# EAGLE design OBC_QB50 (EAGLE 6.5.0)
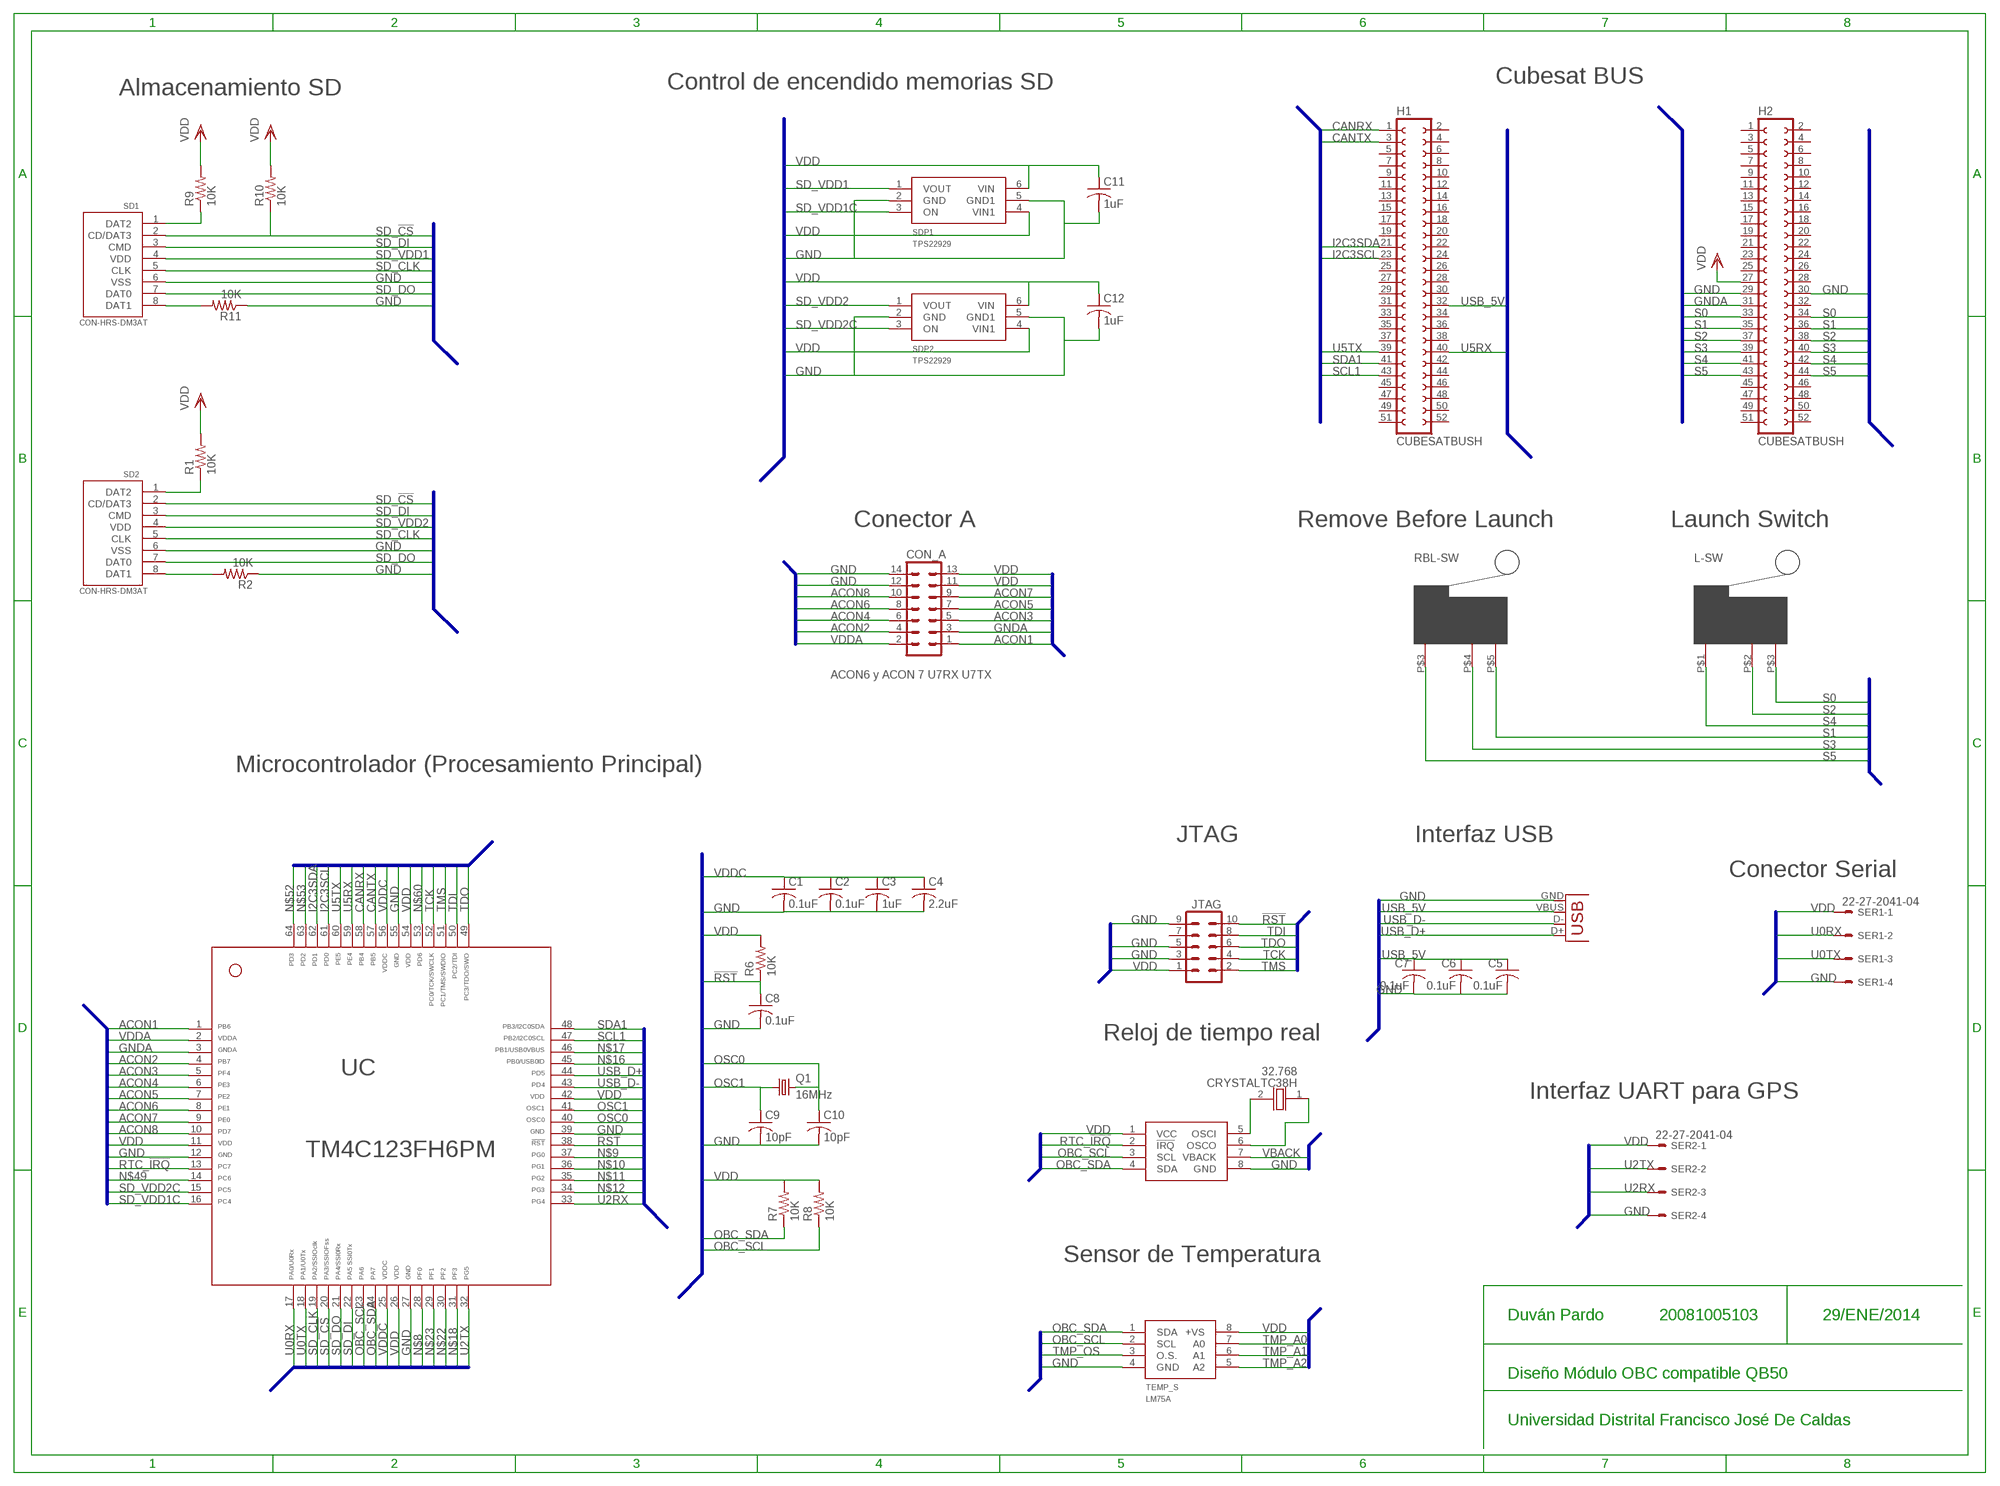
[diagram p0: schematic, sheet 1]

## Parts
32.768  CRYSTALTC38H  [TC38H]
C1  0.1uF  C-USC0402  [C0402]
C2  0.1uF  C-USC0402  [C0402]
C3  1uF  C-USC0402  [C0402]
C4  2.2uF  C-USC0402  [C0402]
C5  0.1uF  C-USC0402  [C0402]
C6  0.1uF  C-USC0402  [C0402]
C7  0.1uF  C-USC0402  [C0402]
C8  0.1uF  C-USC0402  [C0402]
C9  10pF  C-USC0402  [C0402]
C10  10pF  C-USC0402  [C0402]
C11  1uF  C-USC0402  [C0402]
C12  1uF  C-USC0402  [C0402]
CON_A  ML14  [ML14]
H1  CUBESATBUSH  [CUBESATBUS]
H2  CUBESATBUSH  [CUBESATBUS]
JTAG  ML10  [ML10]
L-SW  SW_E61-SERIESCON  [CON]
Q1  16MHz  CRYSTALHC49UP  [HC49UP]
R1  10K  R-US_MELF0102R  [MINI_MELF-0102R]
R2  10K  R-US_MELF0102R  [MINI_MELF-0102R]
R6  10K  R-US_MELF0102R  [MINI_MELF-0102R]
R7  10K  R-US_MELF0102R  [MINI_MELF-0102R]
R8  10K  R-US_MELF0102R  [MINI_MELF-0102R]
R9  10K  R-US_MELF0102R  [MINI_MELF-0102R]
R10  10K  R-US_MELF0102R  [MINI_MELF-0102R]
R11  10K  R-US_MELF0102R  [MINI_MELF-0102R]
RBL-SW  SW_E61-SERIES  [E61-SERIES]
RTC  BQ32008SOIC  [SOP08]
SD1  CON-HRS-DM3AT  [HRS-DM3AT]
SD2  CON-HRS-DM3AT  [HRS-DM3AT]
SDP1  TPS22929  [SOT23-6L]
SDP2  TPS22929  [SOT23-6L]
SER1  22-27-2041-04  [6410-04]
SER2  22-27-2041-04  [6410-04]
TEMP_S  LM75A  [SOP08]
UC  TM4C123FH6PM  [TM4C123FH6PM]
USB  USB-B-H  [USB-B-H]

## Nets
!RST: C8.1 JTAG.10 R6.1 UC.38
ACON1: CON_A.1 UC.1
ACON2: CON_A.4 UC.4
ACON3: CON_A.5 UC.5
ACON4: CON_A.6 UC.6
ACON5: CON_A.7 UC.7
ACON6: CON_A.8 UC.8
ACON7: CON_A.9 UC.9
ACON8: CON_A.10 UC.10
CANRX: H1.1 UC.58
CANTX: H1.3 UC.57
GND: C1.2 C2.2 C3.2 C4.2 C5.2 C6.2 C7.2 C8.2 C9.2 C10.2 C11.2 C12.2 CON_A.12 CON_A.14 H2.29 H2.30 JTAG.3 JTAG.5 JTAG.9 R2.1 R11.1 RTC.8(GND) SD1.6(VSS) SD2.6(VSS) SDP1.2(GND) SDP1.5(GND1) SDP2.2(GND) SDP2.5(GND1) SER1.4 SER2.4 TEMP_S.4(GND) UC.12 UC.27 UC.39 UC.55 USB.GND
GNDA: CON_A.3 H2.31 UC.3
I2C3SCL: H1.23 UC.61
I2C3SDA: H1.21 UC.62
N$3: R1.1 SD2.1(DAT2)
N$4: R2.2 SD2.8(DAT1)
N$5: 32.768.2(X2) RTC.5(OSCI)
N$6: 32.768.1(X1) RTC.6(OSCO)
N$8: UC.28
N$9: UC.37
N$10: UC.36
N$11: UC.35
N$12: UC.34
N$15: R9.1 SD1.1(DAT2)
N$16: UC.45
N$17: UC.46
N$18: UC.31
N$19: R11.2 SD1.8(DAT1)
N$22: UC.30
N$23: UC.29
N$49: UC.14
N$52: UC.64
N$53: UC.63
N$60: UC.53
OBC_SCL: R8.1 RTC.3(SCL) TEMP_S.2(SCL) UC.23
OBC_SDA: R7.1 RTC.4(SDA) TEMP_S.1(SDA) UC.24
OSC0: C10.1 Q1.2 UC.40
OSC1: C9.1 Q1.1 UC.41
RTC_!IRQ: RTC.2(!IRQ) UC.13
S0: H2.33 H2.34 L-SW.P$3(NC)
S1: H2.35 H2.36 RBL-SW.P$5(NC)
S2: H2.37 H2.38 L-SW.P$2(NO)
S3: H2.39 H2.40 RBL-SW.P$4(NO)
S4: H2.41 H2.42 L-SW.P$1(C)
S5: H2.43 H2.44 RBL-SW.P$3(C)
SCL1: H1.43 UC.47
SD_!CS: R10.1 SD1.2(CD/DAT3) SD2.2(CD/DAT3) UC.20
SD_CLK: SD1.5(CLK) SD2.5(CLK) UC.19
SD_DI: SD1.3(CMD) SD2.3(CMD) UC.22
SD_DO: SD1.7(DAT0) SD2.7(DAT0) UC.21
SD_VDD1: SD1.4(VDD) SDP1.1(VOUT)
SD_VDD1C: SDP1.3(ON) UC.16
SD_VDD2: SD2.4(VDD) SDP2.1(VOUT)
SD_VDD2C: SDP2.3(ON) UC.15
SDA1: H1.41 UC.48
TCK: JTAG.4 UC.52
TDI: JTAG.8 UC.50
TDO: JTAG.6 UC.49
TMP_A0: TEMP_S.7(A0)
TMP_A1: TEMP_S.6(A1)
TMP_A2: TEMP_S.5(A2)
TMP_OS: TEMP_S.3(O.S.)
TMS: JTAG.2 UC.51
U0RX: SER1.2 UC.17
U0TX: SER1.3 UC.18
U2RX: SER2.3 UC.33
U2TX: SER2.2 UC.32
U5RX: H1.40 UC.59
U5TX: H1.39 UC.60
USB_5V: C5.1 C6.1 C7.1 H1.32 USB.VBUS
USB_D+: UC.44 USB.D+
USB_D-: UC.43 USB.D-
VBACK: RTC.7(VBACK)
VDD: C11.1 C12.1 CON_A.11 CON_A.13 H2.27 JTAG.1 R1.2 R6.2 R7.2 R8.2 R9.2 R10.2 RTC.1(VCC) SDP1.4(VIN1) SDP1.6(VIN) SDP2.4(VIN1) SDP2.6(VIN) SER1.1 SER2.1 TEMP_S.8(+VS) UC.11 UC.26 UC.42 UC.54
VDDA: CON_A.2 UC.2
VDDC: C1.1 C2.1 C3.1 C4.1 UC.25 UC.56
Unconnected: H1.2 H1.4 H1.5 H1.6 H1.7 H1.8 H1.9 H1.10 H1.11 H1.12 H1.13 H1.14 H1.15 H1.16 H1.17 H1.18 H1.19 H1.20 H1.22 H1.24 H1.25 H1.26 H1.27 H1.28 H1.29 H1.30 H1.31 H1.33 H1.34 H1.35 H1.36 H1.37 H1.38 H1.42 H1.44 H1.45 H1.46 H1.47 H1.48 H1.49 H1.50 H1.51 H1.52 H2.1 H2.2 H2.3 H2.4 H2.5 H2.6 H2.7 H2.8 H2.9 H2.10 H2.11 H2.12 H2.13 H2.14 H2.15 H2.16 H2.17 H2.18 H2.19 H2.20 H2.21 H2.22 H2.23 H2.24 H2.25 H2.26 H2.28 H2.32 H2.45 H2.46 H2.47 H2.48 H2.49 H2.50 H2.51 H2.52 JTAG.7

## Buses
B$1
B$2
B$3
B$4
B$5
B$6
B$7
B$8
B$9
B$10
B$11
B$12
B$13
B$14
B$15
B$16
B$17
B$18
B$19
B$20
B$21
B$22
B$23

## Notes on the sheet
- Control de encendido memorias SD
- Cubesat BUS
- Almacenamiento SD
- Conector A | Remove Before Launch | Launch Switch
- ACON6 y ACON 7 U7RX U7TX
- Microcontrolador (Procesamiento Principal)
- JTAG | Interfaz USB
- Conector Serial
- Reloj de tiempo real
- Interfaz UART para GPS
- Sensor de Temperatura
- Duván Pardo | 20081005103 | 29/ENE/2014
- Diseño Módulo OBC compatible QB50
- Universidad Distrital Francisco José De Caldas

## Library data of the parts
32.768 = CR_32.768k:CRYSTAL: Generic Crystal TC38H 32.768
C1-C12 = rcl:C-US: CAPACITOR, American symbol
CON_A = con-ml:ML14: HARTING; OC_FARNELL: unknown; OC_NEWARK: unknown
H1 H2 = freetronics-jon:CUBESATBUS
JTAG = con-ml:ML10: HARTING; OC_FARNELL: unknown; OC_NEWARK: unknown
L-SW RBL-SW = SW_E61-Series:SW_E61-SERIES: SW-E61-SERIES
Q1 = crystal:CRYSTAL: CRYSTAL; OC_FARNELL: unknown; OC_NEWARK: unknown
R1 R2 R6-R11 = rcl:R-US_: RESISTOR, American symbol
RTC = BQ32000:BQ3200
SD1 SD2 = BreakoutBoard:CON-HRS-DM3AT: Hirose DM3AT microSD card connector Hirose DM3AT Push-Push (ejection mechanism), top board mounting microSD card connector Source: http://www.hirose.co.jp/cataloge_hp/e60900232.pdf; DIGI-KEY#: HR1964CT-ND; MF: Hirose; MPN: DM3AT-SF-PEJM5; TERMINATION-TYPE: Right-angle SMT (standard)
SDP1 SDP2 = TPS22929:TPS22929: Description The TPS22929 is a small, low rON load switch with controlled turn on. The device contains a P-channel MOSFET that can operate over an input voltage range of 1.4 V to 5.5 V. The switch is controlled by an on/off input (ON), which is capable of interfacing directly with low-voltage control signals. The TPS22929 is active high enable. The TPS22929 contains a 150-Ω on-chip load resistor for quick output discharge when the switch is turned off. The rise time of the device is internally controlled in order to avoid inrush current. The TPS22929 family has various slew rate options. The TPS22929 device provides circuit breaker functionality by latching off the power-switch during reverse voltage situations. An internal reverse voltage comparator disables the power-switch when the output voltage (VOUT) is driven higher than the input (VIN) to quickly (10µs typ) stop the flow of current towards the input side of the switch. Reverse current is always active, even when the power-switch is disabled. Additionally, under-voltage lockout (UVLO) protection turns the switch off if the input voltage is too low. The TPS22929 is available in an small, space-saving 6-pin SOT23-6 package and is characterized for operation over the free-air temperature range of –40°C to 85°C.
SER1 SER2 = con-molex:22-?-04: CONNECTOR wire to board 2.54 mm (.1 inch) pitch header; OC_FARNELL: unknown; OC_NEWARK: unknown
TEMP_S = LM75A:LM75A
UC = tm4C123FH6PMlbr:TM4C123FH6PM: TM4C123FH6PM
USB = con-usb:USB: USB Connectors

## Board
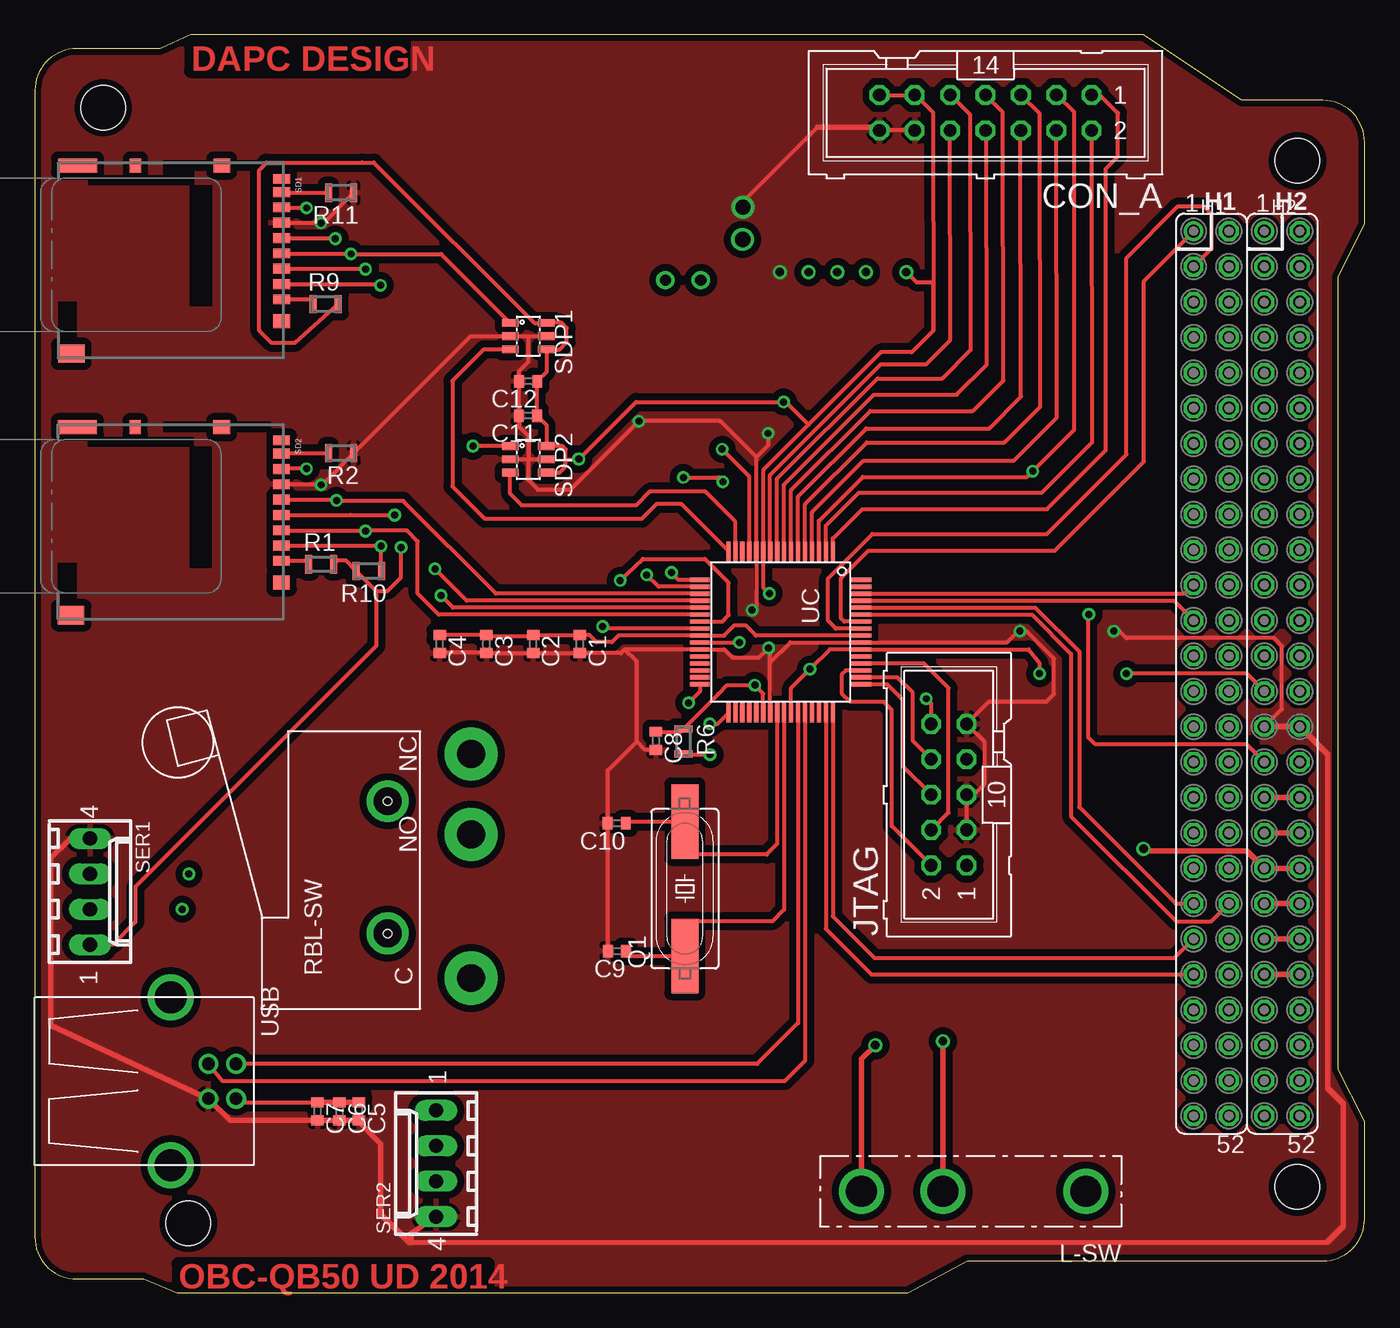
[diagram p1: board, top side]
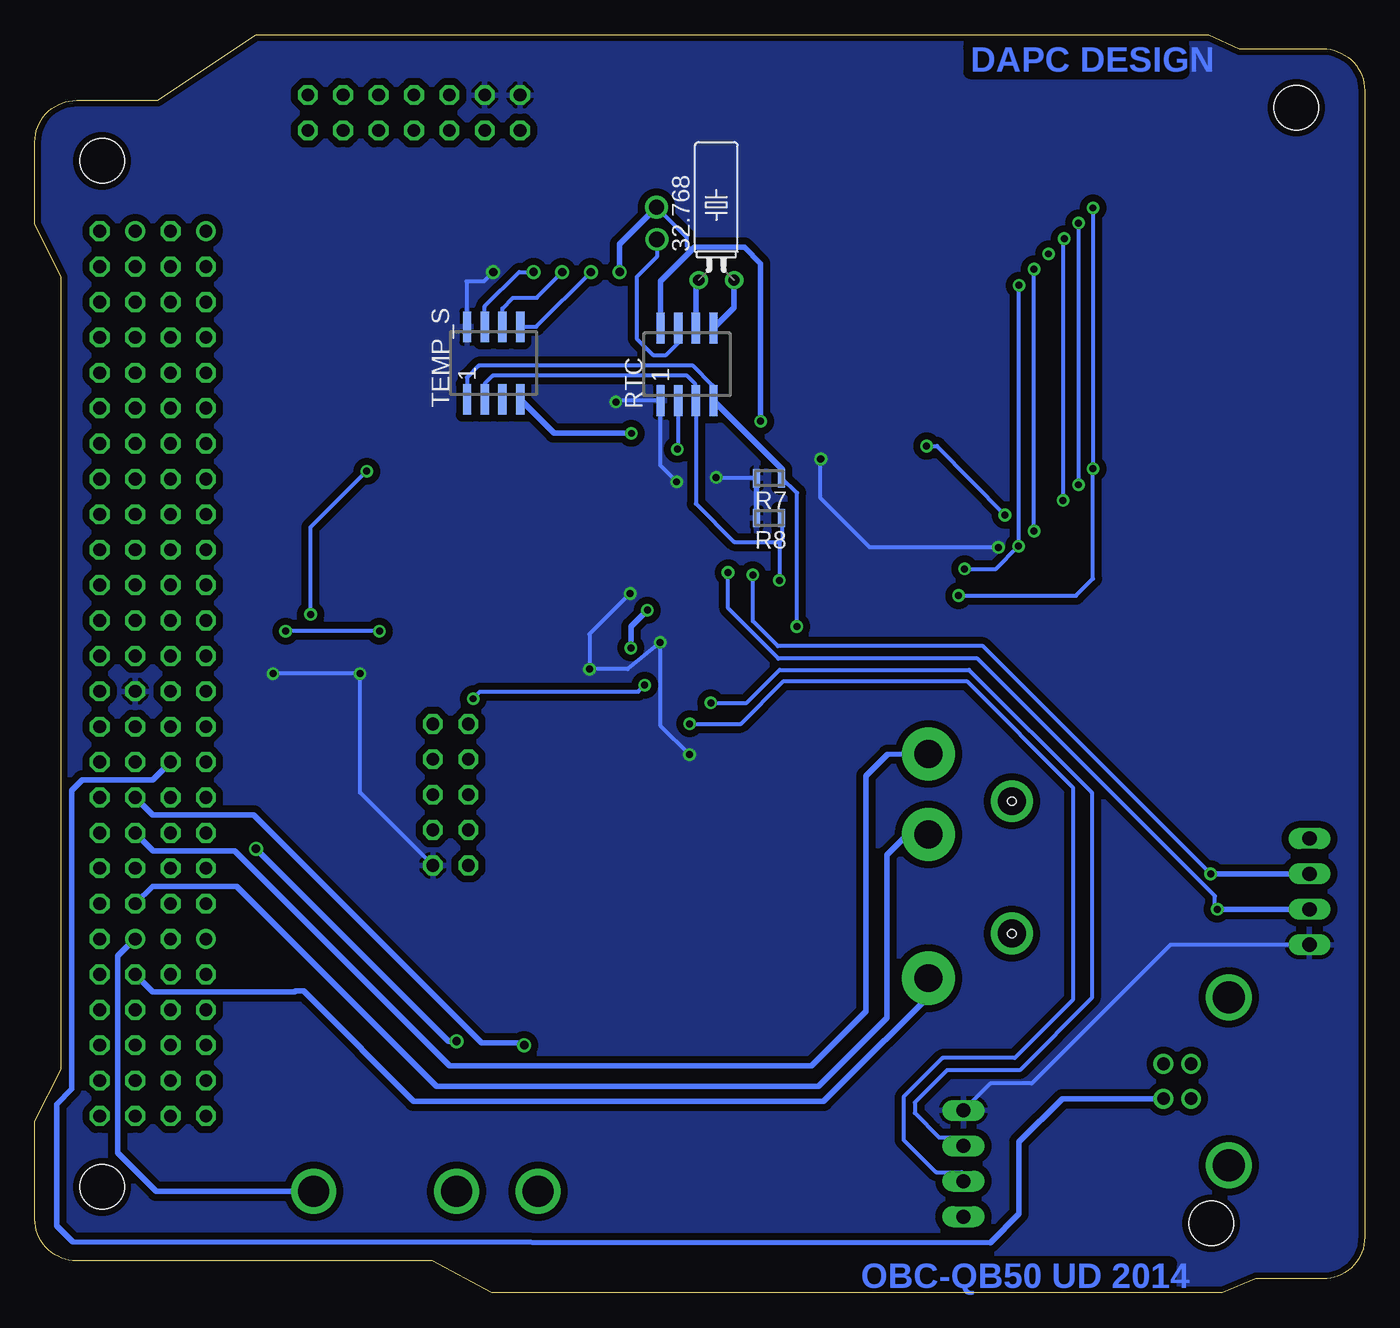
[diagram p2: board, bottom side, seen from below]

Size 95.45 x 90.3 mm. Coordinates in mm from the lower left corner, seen from the top.
Outline: 0,4 arc90 3,1 7.81,1 10.23,0 62.65,0 66.94,2.3 92.45,2.3 arc90 95.45,5.3 95.45,12.31 93.55,16.05 93.55,72.91 95.45,76.74 95.45,82.6 arc90 92.45,85.6 86.64,85.6 79.56,90.3 11.2,90.3 9,89.3 3,89.3 arc90 0,86.3 0,4
Copper layers (1+2*15+16): Top 0.035mm / dielectric 1.5mm / Route2 0.035mm / dielectric 0.15mm / Route15 0.035mm / dielectric 0.2mm / Bottom 0.035mm
Design rules "default *": minimum track width 6mil, minimum drill 24mil, track to track 0.5mm, track to pad 0.5mm, pad to pad 0.5mm, via to via 0.5mm, smd to smd 0.5mm, copper to edge 18mil, drill to drill 8mil, minimum pad ring 10mil, minimum via ring 8mil, stop-mask expansion 4mil, vias tented up to drill 0mil, thermal gap 10mil
Holes 3.2 mm at 11.02,5 4.91,85.07 90.63,81.26 90.63,7.6

### Footprints (pad centres in the part's own frame; a part is rotated, then mirrored left to right if it is on the bottom)
TC38H = drill 0.813: 1 -1.27,0; 2 1.27,0
C0402 = smd 0.7 x 0.9: 1 -0.65,0; 2 0.65,0
ML14 = drill 0.914 octagon: 1 -7.62,-1.27; 2 -7.62,1.27; 3 -5.08,-1.27; 4 -5.08,1.27; 5 -2.54,-1.27; 6 -2.54,1.27; 7 0,-1.27; 8 0,1.27; 9 2.54,-1.27; 10 2.54,1.27; 11 5.08,-1.27; 12 5.08,1.27; 13 7.62,-1.27; 14 7.62,1.27
CUBESATBUS = drill 0.914: 1 -31.75,-1.27; 41 19.05,-1.27 | drill 0.914 octagon: 2 -31.75,1.27; 3 -29.21,-1.27; 4 -29.21,1.27; 5 -26.67,-1.27; 6 -26.67,1.27; 7 -24.13,-1.27; 8 -24.13,1.27; 9 -21.59,-1.27; 10 -21.59,1.27; 11 -19.05,-1.27; 12 -19.05,1.27; 13 -16.51,-1.27; 14 -16.51,1.27; 15 -13.97,-1.27; 16 -13.97,1.27; 17 -11.43,-1.27; 18 -11.43,1.27; 19 -8.89,-1.27; 20 -8.89,1.27; 21 -6.35,-1.27; 22 -6.35,1.27; 23 -3.81,-1.27; 24 -3.81,1.27; 25 -1.27,-1.27; 26 -1.27,1.27; 27 1.27,-1.27; 28 1.27,1.27; 29 3.81,-1.27; 30 3.81,1.27; 31 6.35,-1.27; 32 6.35,1.27; 33 8.89,-1.27; 34 8.89,1.27; 35 11.43,-1.27; 36 11.43,1.27; 37 13.97,-1.27; 38 13.97,1.27; 39 16.51,-1.27; 40 16.51,1.27; 42 19.05,1.27; 43 21.59,-1.27; 44 21.59,1.27; 45 24.13,-1.27; 46 24.13,1.27; 47 26.67,-1.27; 48 26.67,1.27; 49 29.21,-1.27; 50 29.21,1.27; 51 31.75,-1.27; 52 31.75,1.27
ML10 = drill 0.914 octagon: 1 -5.08,-1.27; 2 -5.08,1.27; 3 -2.54,-1.27; 4 -2.54,1.27; 5 0,-1.27; 6 0,1.27; 7 2.54,-1.27; 8 2.54,1.27; 9 5.08,-1.27; 10 5.08,1.27
CON = drill 2.2: P$1 -8.89,0; P$2 1.37,0; P$3 7.22,0
HC49UP = smd 5.334 x 1.93: 1 -4.826,0; 2 4.826,0
MINI_MELF-0102R = smd 0.5 x 1.3: 1 -0.9,0; 2 0.9,0
E61-SERIES = drill 2 pad 2.184: P$1 -4.61,-2.16; P$2 4.89,-2.16 | drill 2 pad 3.81: P$3 -7.81,-8.16; P$4 2.49,-8.16; P$5 8.29,-8.16 | hole 0.6: -4.61,-2.16; 4.89,-2.16
SOP08 = smd 0.6 x 2.2: 1 -1.905,-2.6; 2 -0.635,-2.6; 3 0.635,-2.6; 4 1.905,-2.6; 5 1.905,2.6; 6 0.635,2.6; 7 -0.635,2.6; 8 -1.905,2.6
HRS-DM3AT = smd 0.7 x 1.2: 1 2.54,9.49; 2 1.44,9.49; 3 0.34,9.49; 4 -0.76,9.49; 5 -1.86,9.49; 6 -2.96,9.49; 7 -4.06,9.49; 8 -5.16,9.49; B -6.11,9.49 | smd 1 x 0.8: A -7.06,-1.01 | smd 1 x 1.2: MNT@1 -7.06,5.19; MNT@4 4.09,9.49 | smd 1 x 2.8: MNT@2 -7.06,-5.16 | smd 1.3 x 1.9: MNT@3 6.44,-5.61
SOT23-6L = smd 0.55 x 1.2: 1 -0.95,-1.3; 2 0,-1.3; 3 0.95,-1.3; 4 0.95,1.3; 5 0,1.3; 6 -0.95,1.3
6410-04 = drill 1.016 long: 1 3.81,0; 2 1.27,0; 3 -1.27,0; 4 -3.81,0
TM4C123FH6PM = smd 1.4 x 0.3: 1 -5.8,3.75; 2 -5.8,3.25; 3 -5.8,2.75; 4 -5.8,2.25; 5 -5.8,1.75; 6 -5.8,1.25; 7 -5.8,0.75; 8 -5.8,0.25; 9 -5.8,-0.25; 10 -5.8,-0.75; 11 -5.8,-1.25; 12 -5.8,-1.75; 13 -5.8,-2.25; 14 -5.8,-2.75; 15 -5.8,-3.25; 16 -5.8,-3.75; 33 5.8,-3.75; 34 5.8,-3.25; 35 5.8,-2.75; 36 5.8,-2.25; 37 5.8,-1.75; 38 5.8,-1.25; 39 5.8,-0.75; 40 5.8,-0.25; 41 5.8,0.25; 42 5.8,0.75; 43 5.8,1.25; 44 5.8,1.75; 45 5.8,2.25; 46 5.8,2.75; 47 5.8,3.25; 48 5.8,3.75 | smd 0.3 x 1.4: 17 -3.75,-5.8; 18 -3.25,-5.8; 19 -2.75,-5.8; 20 -2.25,-5.8; 21 -1.75,-5.8; 22 -1.25,-5.8; 23 -0.75,-5.8; 24 -0.25,-5.8; 25 0.25,-5.8; 26 0.75,-5.8; 27 1.25,-5.8; 28 1.75,-5.8; 29 2.25,-5.8; 30 2.75,-5.8; 31 3.25,-5.8; 32 3.75,-5.8; 49 3.75,5.8; 50 3.25,5.8; 51 2.75,5.8; 52 2.25,5.8; 53 1.75,5.8; 54 1.25,5.8; 55 0.75,5.8; 56 0.25,5.8; 57 -0.25,5.8; 58 -0.75,5.8; 59 -1.25,5.8; 60 -1.75,5.8; 61 -2.25,5.8; 62 -2.75,5.8; 63 -3.25,5.8; 64 -3.75,5.8
USB-B-H = drill 0.914: D+ 0,1.25; D- 1.981,1.25; GND 0,-1.25; VBUS 1.981,-1.25 | drill 2.286: P$1 -2.718,-6.02; P$2 -2.718,6.02

### Placement (x,y rotation side)
32.768  46.53,72.69 0 bottom
C1  39.12,46.57 270 top
C2  35.76,46.57 270 top
C3  32.41,46.57 270 top
C4  29.06,46.57 270 top
C5  23.27,13.03 270 top
C6  21.87,13.03 270 top
C7  20.29,13.03 270 top
C8  44.58,39.62 270 top
C9  41.78,24.54 180 top
C10  41.76,33.71 180 top
C11  35.39,62.97 180 top
C12  35.41,65.44 180 top
CON_A  68.24,84.71 180 top
H1  84.44,44.45 270 top
H2  89.52,44.45 270 top
JTAG  65.61,35.76 90 top
L-SW  66.55,7.29 180 top
Q1  46.66,29.01 90 top
R1  20.56,52.3 0 top
R2  21.98,60.27 180 top
R6  46.57,39.59 270 top
R7  42.75,58.47 180 bottom
R8  42.75,55.63 180 bottom
R9  20.88,70.97 0 top
R10  23.98,51.8 180 top
R11  21.97,78.96 180 top
RBL-SW  23.16,30.4 90 top
RTC  48.64,66.65 0 bottom
SD1  8.23,73.85 270 top
SD2  8.22,55.08 270 top
SDP1  35.42,68.67 270 top
SDP2  35.42,59.83 270 top
SER1  3.96,28.8 270 top
SER2  28.8,9.28 90 top
TEMP_S  62.52,66.74 0 bottom
UC  53.53,47.43 270 top
USB  12.46,15.19 0 top

### Tracks (layer width: path | path; a pad name or v marks a point on that pad's centre or on a via)
!RST  (via drill 0.5)
  Top 0.305: R6.1 46.72,40.57 | 63.98,42.67 v63.98,42.65 64.34,42.29 JTAG.10 | R6.1 49.06,43 49.68,43.62 v51.68,43.62 52.28,43.02 UC.38 | C8.1 46.33,40.27 R6.1
  Bottom 0.305: v63.98,42.65 63.47,43.15 52.15,43.15 v51.68,43.62
ACON1
  Top 0.305: CON_A.1 76.44,85.98 77.74,84.68 77.74,81.56 76.86,80.68 76.86,60.48 72.64,56.26 59.39,56.26 57.28,54.15 UC.1
ACON2
  Top 0.305: UC.4 55.78,56.04 59.48,59.74 70.27,59.74 73.36,62.83 CON_A.4
ACON3
  Top 0.305: UC.5 55.28,56.6 59.71,61.04 69.59,61.04 72.16,63.61 72.12,84.63 CON_A.5
ACON4
  Top 0.305: UC.6 54.78,57.16 59.68,62.05 68.5,62.05 70.79,64.34 70.75,83.44 CON_A.6
ACON5
  Top 0.305: UC.7 54.28,57.62 59.96,63.3 67.32,63.3 69.52,65.5 69.48,84.73 CON_A.7
ACON6
  Top 0.305: UC.8 53.78,58.02 60.23,64.47 66.15,64.47 68.33,66.64 68.29,83.44 CON_A.8
ACON7
  Top 0.305: UC.9 53.28,58.43 60.48,65.63 65.12,65.63 67.18,67.69 67.14,84.58 65.74,85.98 CON_A.9
ACON8
  Top 0.305: UC.10 52.78,58.71 60.72,66.65 63.98,66.65 65.71,68.38 65.67,83.44 CON_A.10
CANRX
  Top 0.305: UC.58 58.1,48.18 57.86,48.42 57.86,51.3 59.84,53.28 73.2,53.28 79.6,59.68 79.6,72.63 H1.1
CANTX
  Top 0.305: UC.57 57.5,47.68 56.93,48.25 56.93,51.29 60.11,54.47 72.64,54.47 78.35,60.17 78.35,74.28 82.05,77.99 83.91,77.99 84.45,77.44 84.45,74.94 H1.3
GND  (via drill 0.5, 0.6, 1.1)
  Top 0.305: 52.78,45.24 54.23,46.69 UC.55 69.77,46.68 70.59,47.5 v70.71,47.5 71.17,47.5 73.15,45.52 73.15,43 72.59,42.44 68.48,42.44 JTAG.9 68.15,39.57 68.15,36.5 67.41,35.76 JTAG.5 JTAG.3 | C4.2 29.03,45.92 29.03,45.99 32.41,45.99 C3.2 32.44,45.92 32.44,45.94 C2.2 C1.2 42.08,45.92 42.34,46.18 | 42.34,46.18 UC.27 49.48,46.18 50.08,45.59 51.97,45.59 v52.67,46.29 52.78,46.18 52.78,45.24 | H2.29 89.51,41.9 89.51,46.43 88.95,46.99 78.36,46.99 77.85,47.5 v77.44,47.5 | C8.2 43.8,38.97 43.21,39.57 | 43.21,39.57 43.21,45.32 42.34,46.18 | C10.2 41.13,33.71 C9.2 41.13,37.5 43.21,39.57 | 51.78,59.98 UC.12 51.78,49.3 v51.49,49.01 | 51.78,59.98 49.2,62.56 v43.36,62.56 | CON_A.12 CON_A.14 arc90 60.39,83.67 | v50.83,77.93 50.83,78.32 56.17,83.67 | 35.52,68.67 SDP1.2 31.28,68.67 R2.1 20.61,58 v20.54,58 20.54,58.04 SD2.6 | 35.52,68.67 SDP1.5 | 35.42,59.83 35.39,59.83 | 35.39,59.83 SDP2.2 | 35.52,68.67 35.42,68.57 35.42,66.83 34.76,66.16 C12.2 34.74,65.43 C11.2 34.75,62.17 35.42,61.49 35.42,59.83 | SDP2.5 35.42,59.83 | 43.17,62.56 v43.36,62.56 | 35.39,59.83 35.39,58.37 36.11,57.66 38.46,57.66 v43.36,62.56 | v52.63,61.7 52.63,60.83 51.78,59.98 | SD1.6 20.54,76.81 v20.54,76.8 20.71,76.8 R11.1 | UC.39 52.78,45.24
  Top 0.406: 60.39,83.67 56.17,83.67 | 27,3.58 92.76,3.63 93.9,4.78 93.9,13.56 92.79,14.68 92.79,38.64 H2.30 H2.29 | 27,3.58 26.9,3.58 24.83,5.65 24.83,10.71 23.15,12.38 C5.2 C6.2 C7.2 14.02,12.38 USB.GND 1.13,19.21 1.13,31.2 2.53,32.6 3.95,32.6 SER1.4 | SER2.4 27,4.27 27,3.58
  Bottom 0.305: v70.71,47.5 v77.44,47.5 | 48.32,74.84 48.64,75.16 48.64,75.74 v50.83,77.93 | v43.36,62.56 43.21,62.41 43.08,62.41 | v20.54,76.8 v20.54,58
  Bottom 0.406: RTC.8 50.55,72.62 48.32,74.84 48.11,75.06 44.53,75.06 43.36,73.89 v43.36,62.56 | v52.63,61.7 58.18,61.7 TEMP_S.4 | v53.47,73.28 53.47,75.29 v50.83,77.93 | v51.49,49.01 52.67,47.83 v52.67,46.29
  pour Top: 0,86.3 arc-90 3,89.3 9,89.3 11.2,90.3 79.56,90.3 86.64,85.6 92.45,85.6 arc-90 95.45,82.6 95.45,76.74 93.55,72.91 93.55,16.05 95.45,12.31 95.45,5.08 arc-90 92.45,2.3 66.94,2.3 62.65,0 10.16,0 7.81,1 3,1 arc-90 0,4
GNDA  (via drill 0.5)
  Top 0.305: H2.31 86.98,39.37 76.12,39.37 75.62,39.88 75.62,48.67 v75.65,48.7 | UC.3 56.28,55.42 59.44,58.57 71.22,58.57 v71.63,58.98 74.6,61.95 74.6,84.75 73.37,85.98 CON_A.3
  Bottom 0.305: 71.65,58.95 v71.63,58.98 75.65,54.95 v75.65,48.7
I2C3SCL
  Top 0.305: UC.61 81.75,49.68 H1.23
I2C3SDA
  Top 0.305: UC.62 82.55,50.18 H1.21
N$3
  Top 0.305: R1.1 19.65,52.54 SD2.1
N$4
  Top 0.305: SD2.8 17.74,60.27 R2.2
N$5
  Bottom 0.406: RTC.5 45.26,70.72 32.768.2
N$6
  Bottom 0.406: RTC.6 48.01,72.69 32.768.1
N$15
  Top 0.305: R9.1 19.99,71.31 SD1.1
N$19
  Top 0.305: SD1.8 17.77,78.96 R11.2
OBC_SCL  (via drill 0.5)
  Top 0.305: UC.23 49.34,48.18 49.8,48.64 49.8,50.98 48.09,52.68 43.64,52.68 v42.01,51.14
  Bottom 0.305: R8.1 41.8,54.11 42.01,53.9 | 42.01,53.9 v42.01,51.14 | 42.01,53.9 45.26,53.9 48.01,56.64 RTC.3 48.03,64.07 48.03,65.23 48.63,65.82 62.59,65.82 63.16,65.25 TEMP_S.2
OBC_SDA  (via drill 0.5)
  Top 0.305: UC.24 40.75,47.68 v40.75,47.83
  Bottom 0.305: v40.75,47.83 40.74,57.41 R7.1 | RTC.4 46.8,64.11 46.8,65.14 48.21,66.55 63.59,66.55 64.43,65.71 TEMP_S.1
  Bottom 0.406: R7.1 41.8,59.11 RTC.4
OSC0
  Top 0.305: UC.40 53.28,32.23 52.52,31.47 46.58,31.47 46.58,33.83 Q1.2 42.41,33.83 C10.1
OSC1
  Top 0.305: UC.41 53.78,27.51 52.94,26.67 46.63,26.67 46.63,24.18 Q1.1 42.43,24.18 C9.1
RTC_!IRQ  (via drill 0.5)
  Top 0.305: UC.13 51.28,58.6 v49.33,60.55
  Bottom 0.305: RTC.2 49.28,60.6 v49.33,60.55
S0  (via drill 0.6)
  Top 0.406: H2.34 H2.33 | v60.32,17.78 59.33,16.78 L-SW.P$3
  Bottom 0.406: H2.33 87.01,34.32 79.76,34.32 63.4,17.96 60.43,17.96 v60.32,17.78
S1
  Top 0.406: H2.36 H2.35
  Bottom 0.406: RBL-SW.P$5 34.25,38.64 35.79,37.11 35.79,20.22 39.7,16.31 65.68,16.31 81.1,31.72 86.95,31.72 H2.35
S2  (via drill 0.6)
  Top 0.406: H2.38 H2.37 87.01,31.72 79.93,31.72 79.68,31.98 v79.58,31.88 | v65.18,18.06 L-SW.P$2
  Bottom 0.406: v79.58,31.88 65.76,18.06 v65.18,18.06
S3
  Top 0.406: H2.40 H2.39
  Bottom 0.406: RBL-SW.P$4 32.89,32.84 34.29,31.45 34.29,19.74 39.19,14.83 66.62,14.83 80.98,29.18 87.01,29.18 H2.39
S4
  Top 0.406: H2.42 H2.41
  Bottom 0.406: H2.41 88.29,25.4 89.51,24.18 89.51,10.05 86.75,7.29 L-SW.P$1
S5
  Top 0.406: H2.44 H2.43
  Bottom 0.406: RBL-SW.P$3 30.03,22.54 38.84,13.74 68.25,13.74 75.74,21.23 75.74,21.26 76.15,21.67 76.75,21.67 76.81,21.6 86.99,21.6 H2.43
SCL1
  Top 0.305: 83.25,22.86 H1.43 60.06,22.86 56.78,26.14 UC.47
SD_!CS  (via drill 0.5)
  Top 0.305: SD1.2 24.8,72.41 v24.8,72.33 | SD2.2 24.84,53.64 v24.84,53.59 24.84,51.84 R10.1 | UC.20 31,49.68 v28.71,51.97
  Bottom 0.305: v24.8,72.33 24.84,72.33 v24.84,53.59 26.47,51.97 v28.71,51.97
SD_CLK  (via drill 0.5)
  Top 0.305: SD1.5 21.56,75.71 v21.56,75.67 | SD2.5 21.65,56.94 v21.65,56.88 21.69,56.85 26.44,56.85 33.1,50.18 UC.19
  Bottom 0.305: v21.56,75.67 21.65,75.67 v21.65,56.88
SD_DI  (via drill 0.5)
  Top 0.305: SD1.3 23.74,73.51 v23.74,73.48 | SD2.3 17.71,54.69 v23.74,54.69 23.76,54.71 26.7,54.71 27.48,53.93 27.48,50.19 28.99,48.68 UC.22
  Bottom 0.305: v23.74,54.69 v23.74,73.48
SD_DO  (via drill 0.5)
  Top 0.305: SD1.7 19.49,77.91 v19.49,77.88 | v19.49,59.16 17.71,59.16 SD2.7 | UC.21 30.01,49.18 v29.15,50.05
  Bottom 0.305: v19.49,77.88 v19.49,59.16 19.51,59.14 19.51,51.27 20.73,50.05 v29.15,50.05
SD_VDD1  (via drill 0.5)
  Top 0.305: SD1.4 22.69,74.61 v22.69,74.57 29.16,74.57 SDP1.1
SD_VDD1C
  Top 0.305: SDP1.3 32.22,67.72 29.97,65.47 29.97,57.89 32.31,55.55 43.55,55.55 44.61,56.62 46.4,56.62 UC.16
SD_VDD2  (via drill 0.5)
  Top 0.305: SD2.4 22.66,55.84 v25.82,55.83 | SDP2.1 v31.45,60.78
  Bottom 0.305: v31.45,60.78 30.7,60.78 v25.82,55.83
SD_VDD2C
  Top 0.305: UC.15 50.28,55.36 48.14,57.51 44.13,57.51 43.14,56.51 34.96,56.51 34.11,57.37 SDP2.3
SDA1
  Top 0.305: UC.48 57.28,27.03 60.28,24.03 81.8,24.03 H1.41
TCK
  Top 0.305: JTAG.4 65.58,34.47 65.58,43.41 63.8,45.18 UC.52
TDI
  Top 0.305: JTAG.8 63.02,39.62 63.02,43.08 61.91,44.18 UC.50
TDO
  Top 0.305: JTAG.6 62.31,37.8 62.31,42.57 61.19,43.68 UC.49
TMP_A0  (via drill 0.6)
  Bottom 0.305: TEMP_S.7 63.16,70.82 60.69,73.28 v59.65,73.28
TMP_A1  (via drill 0.6)
  Bottom 0.305: TEMP_S.6 61.89,70.66 61.13,71.42 59.44,71.42 v57.59,73.27
TMP_A2  (via drill 0.6)
  Bottom 0.305: TEMP_S.5 59.46,69.34 v55.54,73.27
TMS
  Top 0.305: JTAG.2 61.52,33.5 61.52,41.83 60.91,42.44 58.51,42.44 57.91,43.04 57.91,44.39 58.21,44.68 UC.51
U0RX  (via drill 0.5)
  Top 0.305: UC.17 46.21,51.18 v45.69,51.7
  Bottom 0.305: v10.58,27.53 10.74,27.7 10.74,28.49 27.79,45.53 42.07,45.53 45.69,49.15 v45.69,51.7
  Bottom 0.406: SER1.2 v10.58,27.53
U0TX  (via drill 0.5)
  Top 0.305: UC.18 44.77,50.68 v43.92,51.54
  Bottom 0.305: v11.05,30.07 27.39,46.42 42.13,46.42 43.92,48.21 v43.92,51.54
  Bottom 0.406: SER1.3 v11.05,30.07 | 44.03,51.42 v43.92,51.54
U2RX  (via drill 0.5)
  Top 0.305: v48.45,40.84 48.99,40.84 UC.33
  Bottom 0.305: v48.45,40.84 44.77,40.84 41.71,43.9 28.56,43.9 20.95,36.29 20.95,21.03 25.11,16.87 30.3,16.87 33.1,14.07 33.1,10.99 30.77,8.66 28.93,8.66 SER2.3
U2TX  (via drill 0.5)
  Top 0.305: UC.32 47.73,43.16 v46.93,42.35
  Bottom 0.305: v46.93,42.35 44.36,42.35 42,44.72 28.4,44.72 19.59,35.91 19.59,21.16 24.76,15.99 29.97,15.99 32.3,13.67 32.3,12.92 30.54,11.16 28.97,11.16 SER2.2
U5RX
  Top 0.305: UC.59 71.56,48.68 74.37,45.87 74.37,34.21 81.91,26.67 84.44,26.67 H1.40
U5TX
  Top 0.305: UC.60 71.8,49.18 74.96,46.02 74.96,34.87 81.89,27.94 H1.39
USB_5V
  Top 0.305: 14.7,13.68 22.58,13.68
  Top 0.406: C5.1 23.22,13.73 23.05,13.73 23,13.68 22.58,13.68 C6.1 21.88,13.69 21.88,13.73 21.83,13.68 C7.1 20.31,13.63 | 14.7,13.68 arc-90 USB.VBUS
  Bottom 0.406: H1.32 86.98,36.83 92.05,36.83 92.8,36.08 92.8,14.63 93.89,13.54 93.89,4.8 92.75,3.66 26.87,3.61 24.82,5.66 24.82,10.83 21.71,13.94 USB.VBUS
USB_D+
  Top 0.305: UC.44 55.28,16.66 53.81,15.19 13.5,15.19 USB.D+
USB_D-
  Top 0.305: UC.43 54.78,19.38 51.84,16.44 USB.D-
VBACK  (via drill 1.1)
  Bottom 0.305: RTC.7 49.28,68.17 50.13,67.32 51.06,67.32 52.25,68.5 52.25,72.92 50.8,74.37 v50.8,75.62
VDD  (via drill 0.5, 0.6)
  Top 0.305: H2.27 86.98,44.45 v78.36,44.45 | v72.11,44.45 72.14,45.19 71.32,46.18 UC.54 57.06,46.18 v55.64,44.77 54.28,43.41 UC.42 | CON_A.11 CON_A.13 63.23,85.98 64.45,84.76 64.49,69.06 | 64.49,69.06 62.95,67.51 60.74,67.51 55.53,62.31 | 55.53,62.31 52.28,59.06 UC.11 52.28,50.64 v52.72,50.2 | SDP2.4 37.66,58.88 38.1,59.32 38.1,59.77 | 38.1,59.77 38.1,60.54 37.87,60.77 36.73,60.77 SDP2.6 36.72,62.29 C11.1 36.04,65.43 C12.1 36.72,66.11 SDP1.4 37.65,67.72 38.18,68.25 38.18,69.27 37.81,69.63 36.74,69.63 SDP1.6 35.85,69.62 24.33,81.14 23.49,81.14 23.48,81.13 16.64,81.13 16.1,80.59 16.1,69.08 17.01,68.17 18.65,68.17 R9.2 | 64.49,69.06 64.49,72.52 63.3,72.52 v62.55,73.27 | UC.26 50.15,46.68 v50.57,46.7 | R6.2 46.6,38.66 48.44,38.66 v48.46,38.63 | 24.5,50.38 R10.2 22.33,52.55 21.72,52.55 R1.2 | 24.5,50.38 25.31,50.38 26.29,51.36 v26.29,53.51 | v39.03,59.87 38.93,59.77 38.1,59.77 | 55.53,62.31 53.9,63.94 v53.75,63.94 43.15,63.94 v39.05,59.84 | v46.55,58.53 49.06,58.53 arc-90 v49.38,58.22 | 24.5,50.38 24.5,46.43 7.21,29.15 7.21,26.62 5.59,24.99 SER1.1
  Bottom 0.305: v78.36,44.45 v72.11,44.45 72.11,35.92 JTAG.1 | TEMP_S.8 64.43,72.58 64.46,72.58 64.48,72.61 63.21,72.61 v62.55,73.27 | v52.72,50.2 55.64,47.28 v55.64,44.77 52.91,44.77 v50.57,46.7 50.57,40.74 v48.46,38.63 | v26.29,53.51 35.52,53.51 39.05,57.04 v39.05,59.84 v39.03,59.87 | v53.75,63.94 53.64,64.05 RTC.1 50.55,59.39 v49.38,58.22 | R7.2 46.48,58.47 v46.55,58.53 | SER1.1 13.93,24.99 23.89,15.04 26.86,15.04 SER2.1
  Bottom 0.406: R7.2 R8.2
  pour Bottom: 0,86.3 arc-90 3,89.3 9,89.3 11.2,90.3 79.56,90.3 86.64,85.6 92.45,85.6 arc-90 95.45,82.6 95.45,76.74 93.55,72.91 93.55,16.05 95.45,12.31 95.45,5.08 arc-90 92.45,2.3 66.94,2.3 62.65,0 10.16,0 7.81,1 3,1 arc-90 0,4
VDDA
  Top 0.305: UC.2 56.78,55.07 59.14,57.43 72.26,57.43 75.9,61.06 CON_A.2
VDDC
  Top 0.305: 39.12,47.2 C1.1 | C1.1 C2.1 35.76,47.13 32.41,47.13 C3.1 32.13,47.22 32.13,47.21 29.06,47.21 C4.1 | UC.56 51.75,47.18 51.24,47.69 51.24,47.7 51.05,47.89 50.18,47.89 49.47,47.18 UC.25 41.9,47.18 41.43,46.71 40.31,46.71 39.81,47.21 39.13,47.21 C1.1

### Text on the board
Top: DAPC DESIGN | OBC-QB50 UD 2014
Bottom: DAPC DESIGN | OBC-QB50 UD 2014
tPlace: H1 | H2